# EAGLE design LED_Matrix_3_3_Power (EAGLE 7.7.0)
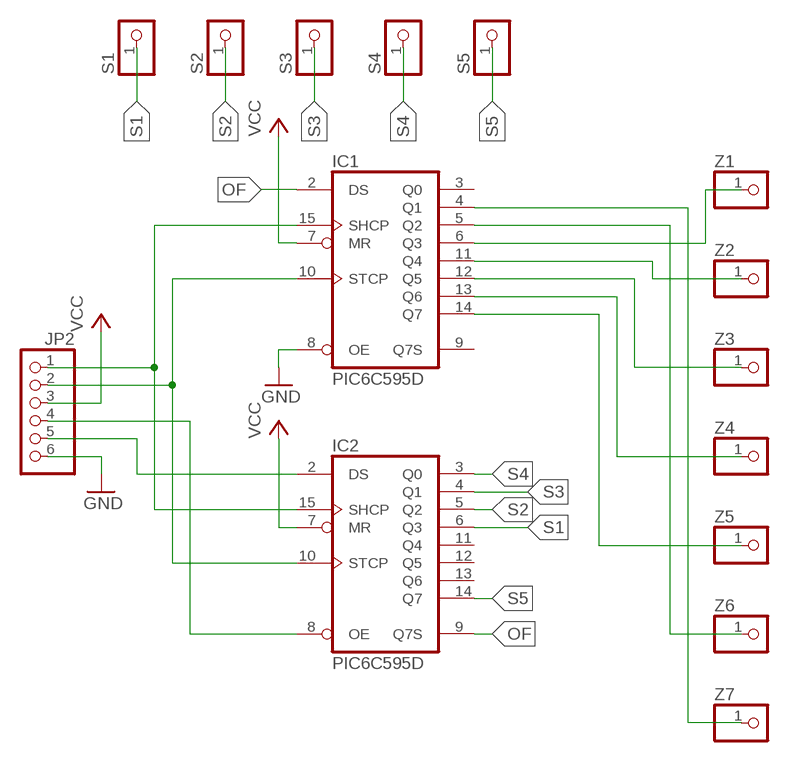
[diagram p0: schematic, sheet 1]

## Parts
IC1  PIC6C595D  [SO16]
IC2  PIC6C595D  [SO16]
JP2  PINHD-1X6  [1X06]
S1  PINHD-1X1  [1X01]
S2  PINHD-1X1  [1X01]
S3  PINHD-1X1  [1X01]
S4  PINHD-1X1  [1X01]
S5  PINHD-1X1  [1X01]
Z1  PINHD-1X1  [1X01]
Z2  PINHD-1X1  [1X01]
Z3  PINHD-1X1  [1X01]
Z4  PINHD-1X1  [1X01]
Z5  PINHD-1X1  [1X01]
Z6  PINHD-1X1  [1X01]
Z7  PINHD-1X1  [1X01]

## Nets
GND: IC1.8(OE) JP2.6
N$1: IC1.10(STCP) IC2.10(STCP) JP2.2
N$2: IC1.15(SHCP) IC2.15(SHCP) JP2.1
N$3: IC2.2(DS) JP2.5
N$4: IC1.4(Q1) Z7.1
N$5: IC1.6(Q3) Z1.1
N$6: IC2.8(OE) JP2.4
N$8: IC1.5(Q2) Z6.1
N$10: IC1.14(Q7) Z5.1
N$11: IC1.13(Q6) Z4.1
N$12: IC1.12(Q5) Z3.1
N$13: IC1.11(Q4) Z2.1
OF: IC1.2(DS) IC2.9(Q7S)
S1: IC2.6(Q3) S1.1
S2: IC2.5(Q2) S2.1
S3: IC2.4(Q1) S3.1
S4: IC2.3(Q0) S4.1
S5: IC2.14(Q7) S5.1
VCC: IC1.7(MR) IC2.7(MR) JP2.3
Unconnected: IC1.3(Q0) IC1.9(Q7S) IC2.11(Q4) IC2.12(Q5) IC2.13(Q6)

## Power pins joined to a net without a drawn wire
GND: IC1.16(GND) IC2.16(GND)
VCC: IC1.1(VCC) IC2.1(VCC)

## Library data of the parts
IC1 IC2 = PIC6C595:PIC6C595: Power Logic 8-Bit Shift Register The PIC6C595 is an 8-bit serial-in/serial or parallel-out shift register with a storage register and open-drain outputs designed for use in systems that require relatively moderate load power such as LEDs. The device contains a built-in voltage clamp on the outputs for inductive transient protection. Power driver applications include relays, solenoids, and other low-current or medium-voltage loads.
JP2 = pinhead:PINHD-1X6: PIN HEADER
S1-S5 Z1-Z7 = pinhead:PINHD-1X1: PIN HEADER

## Board
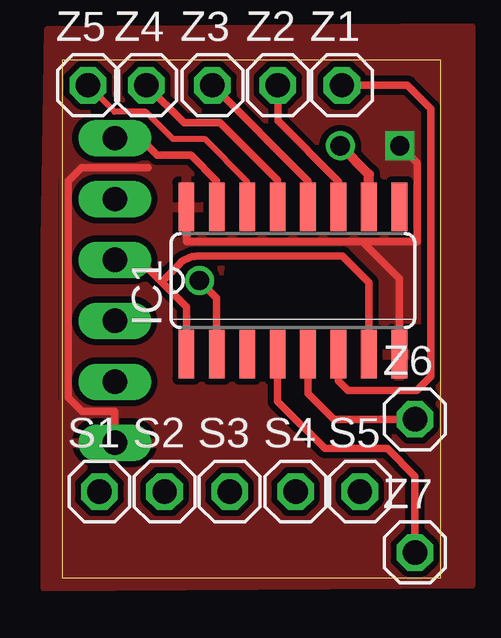
[diagram p1: board, top side]
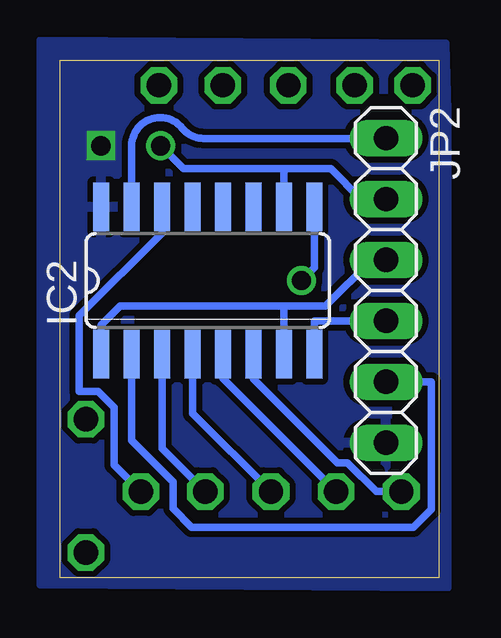
[diagram p2: board, bottom side, seen from below]

Size 15.8 x 21.6 mm. Coordinates in mm from the lower left corner, seen from the top.
Outline: 0,0 15.8,0 15.8,21.6 0,21.6 0,0
Copper layers (1*16): Top 0.035mm / dielectric 1.5mm / Bottom 0.035mm
Design rules "default *": minimum track width 10mil, minimum drill 24mil, track to track 8mil, track to pad 12mil, pad to pad 8mil, via to via 8mil, smd to smd 8mil, copper to edge 0mil, drill to drill 8mil, minimum pad ring 10mil, minimum via ring 8mil, stop-mask expansion 4mil, vias tented up to drill 0mil, thermal gap 10mil
tRestrict: area 5.7,10.9 to 5.9,11.2; area 15.3,7.6 to 15.5,7.6; area 6.8,19.5 to 6.9,19.6; area 11.8,16.9 to 11.9,17; area 14.7,8.7 to 14.9,10.3; area 7,10.7 to 11.9,12.7; area 11.8,10.7 to 12.4,12.2; area 11.2,5.8 to 13.5,6.2; area 9.5,7.5 to 9.7,8; area 10,6.2 to 11,7.2; area 11.2,7 to 13.7,7.6; area 10.8,7.4 to 11.4,7.9
bRestrict: area 12.7,4.8 to 13,5; area 0.8,4.5 to 0.9,4.7; area 13.3,7.8 to 13.6,8.1; area 11.7,16.9 to 12,17.1; area 5.7,10.6 to 6,10.8; area 5.9,13.3 to 11.4,14; area 6.6,11.8 to 12,13.2; area 11.5,11.9 to 13.1,12.2; area 11.8,12.3 to 12.6,12.7; area 7,10.5 to 12.4,11; area 1.9,19.5 to 2.8,19.9; area 2.5,4.3 to 2.7,4.5; 3 more areas

### Footprints (pad centres in the part's own frame; a part is rotated, then mirrored left to right if it is on the bottom)
SO16 = smd 0.66 x 2.032: 1 -4.445,-3.073; 2 -3.175,-3.073; 3 -1.905,-3.073; 4 -0.635,-3.073; 5 0.635,-3.073; 6 1.905,-3.073; 7 3.175,-3.073; 8 4.445,-3.073; 9 4.445,3.073; 10 3.175,3.073; 11 1.905,3.073; 12 0.635,3.073; 13 -0.635,3.073; 14 -1.905,3.073; 15 -3.175,3.073; 16 -4.445,3.073
1X06 = drill 1.016 long: 1 -6.35,0; 2 -3.81,0; 3 -1.27,0; 4 1.27,0; 5 3.81,0; 6 6.35,0
1X01 = drill 1.016 octagon: 1 0,0

### Placement (x,y rotation side)
IC1  9.63,12.4 0 top
IC2  9.63,12.4 0 bottom
JP2  2.2,11.99 270 bottom
S1  1.56,3.6 0 top
S2  4.28,3.6 0 top
S3  7,3.6 0 top
S4  9.74,3.6 0 top
S5  12.43,3.6 0 top
Z1  11.68,20.55 0 top
Z2  9,20.55 0 top
Z3  6.27,20.55 0 top
Z4  3.51,20.55 0 top
Z5  1.08,20.55 0 top
Z6  14.72,6.62 0 top
Z7  14.72,1.06 0 top

### Tracks (layer width: path | path; a pad name or v marks a point on that pad's centre or on a via)
GND  (via drill 0.8)
  Top 0.305: 3.6,17.11 0.82,17.11 0.26,16.55 0.26,7.52 0.84,6.95 2.2,6.95 JP2.6 | IC1.8 14.08,12.49 12.53,14.03 | 12.53,14.03 5.19,14.03 IC1.16 | 12.53,14.03 14.82,14.03 14.82,17.3 v14.09,18.02
  Top 0.406: 14.08,18.01 14.1,18.01 | 14.08,18.02 v14.09,18.02
  pour Bottom (isolate 0.254): 0.09,21.89 0.09,0.17 16.18,0.3 16.18,21.98 11.9,21.85
  pour Top (isolate 0.254): 0.13,21.89 16.19,22.02 16.19,0.3 0.1,0.17 0.1,15.84
N$1  (via drill 0.8)
  Top 0.406: IC1.10 12.81,16.82 v11.61,18.02
  Bottom 0.305: JP2.2 3.24,15.8 4.5,17.06 6.46,17.06 | 6.46,17.06 IC2.10 | 6.46,17.06 10.65,17.06 v11.61,18.02
N$2
  Top 0.305: JP2.1 3.25,18.34 3.97,17.62 5.38,17.62 6.46,16.55 IC1.15
  Bottom 0.305: IC2.15 12.81,18.02 arc141 10.7,18.76 arc-51 9.81,18.33 2.21,18.33 JP2.1
N$3
  Bottom 0.305: JP2.5 0.3,8.18 0.3,2.86 1.05,2.11 10.3,2.11 11.09,2.9 11.09,4.01 12.81,5.73 IC2.2
N$4
  Top 0.305: Z7.1 14.72,4.23 13.56,5.39 10.97,5.39 9,7.36 IC1.4
N$5
  Top 0.305: Z1.1 14.41,20.55 15.38,19.58 15.38,8.39 14.81,7.83 11.92,7.83 11.54,8.21 IC1.6
N$6
  Bottom 0.305: JP2.4 5.19,10.72 IC2.8
N$7
  pour Top (isolate 0.254): -0.61,22.89 17.11,23.02 17.11,-0.33 -0.76,-0.46 -0.76,14
N$8
  Top 0.305: Z6.1 11.34,6.62 10.27,7.69 IC1.5
N$10
  Top 0.254: IC1.14 7.73,16.52 5.94,18.31 4.62,18.31 3.49,19.44 2.19,19.44 Z5.1
N$11
  Top 0.305: Z4.1 5.08,18.98 6.6,18.98 9,16.58 IC1.13
N$12
  Top 0.305: IC1.12 10.27,16.55 Z3.1
N$13
  Top 0.305: Z2.1 9,19.07 11.54,16.53 IC1.11
N$14
  pour Bottom (isolate 0.254): -0.29,22.3 16.61,22.43 16.61,-0.29 -0.38,-0.42 -0.38,19.46
OF  (via drill 0.8)
  Top 0.305: v5.73,12.4 6.46,11.68 IC1.2
  Bottom 0.254: 5.26,15.47 IC2.9
  Bottom 0.305: v5.73,12.4 5.19,12.95 IC2.9
S1
  Bottom 0.305: S1.1 2.6,3.6 3.81,4.8 4.23,4.8 7.73,8.3 IC2.6
S2
  Bottom 0.305: S2.1 9,8.31 IC2.5
S3
  Bottom 0.305: S3.1 10.27,6.87 IC2.4
S4
  Bottom 0.305: S4.1 11.54,5.39 IC2.3
S5
  Bottom 0.305: S5.1 13.54,4.71 13.54,7.11 14.2,7.78 14.99,7.78 14.99,10.94 11.54,14.39 IC2.14 11.61,15.48
VCC
  Top 0.305: IC1.7 12.81,12.32 11.7,13.43 5.72,13.43 arc47 4.9,13.1 4.14,12.34 | IC1.1 5.19,11.3 4.14,12.34 | JP2.3 3.23,13.26 4.14,12.34
  Bottom 0.305: IC2.1 14.08,10.54 13.28,11.34 6.46,11.34 | 6.46,11.34 4.72,11.34 2.8,13.26 JP2.3 | IC2.7 6.46,11.34

### Text on the board
Document: Zusatzanzeiger / -> Steuerungsplatine